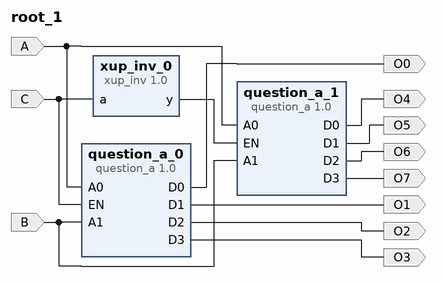
[diagram p0: block diagram of the top level]
# Vivado block design root_1, xc7a35tcpg236-1, Vivado 2023.1
create_bd_design root_1

create_bd_port -dir I A
create_bd_port -dir I B
create_bd_port -dir I C
create_bd_port -dir O O0
create_bd_port -dir O O1
create_bd_port -dir O O2
create_bd_port -dir O O3
create_bd_port -dir O O4
create_bd_port -dir O O5
create_bd_port -dir O O6
create_bd_port -dir O O7

create_bd_cell -type ip -vlnv xilinx.com:user:question_a:1.0 question_a_0
create_bd_cell -type ip -vlnv xilinx.com:user:question_a:1.0 question_a_1
create_bd_cell -type ip -vlnv xilinx.com:XUP:xup_inv:1.0 xup_inv_0

# ---- connections ----

connect_bd_net [get_bd_ports A] [get_bd_pins question_a_0/A0] [get_bd_pins question_a_1/A0]
connect_bd_net [get_bd_ports B] [get_bd_pins question_a_0/A1] [get_bd_pins question_a_1/A1]
connect_bd_net [get_bd_ports C] [get_bd_pins xup_inv_0/a] [get_bd_pins question_a_0/EN]
connect_bd_net [get_bd_pins question_a_0/D0] [get_bd_ports O0]
connect_bd_net [get_bd_pins question_a_0/D1] [get_bd_ports O1]
connect_bd_net [get_bd_pins question_a_0/D2] [get_bd_ports O2]
connect_bd_net [get_bd_pins question_a_0/D3] [get_bd_ports O3]
connect_bd_net [get_bd_pins question_a_1/D0] [get_bd_ports O4]
connect_bd_net [get_bd_pins question_a_1/D1] [get_bd_ports O5]
connect_bd_net [get_bd_pins question_a_1/D2] [get_bd_ports O6]
connect_bd_net [get_bd_pins question_a_1/D3] [get_bd_ports O7]
connect_bd_net [get_bd_pins xup_inv_0/y] [get_bd_pins question_a_1/EN]

validate_bd_design
save_bd_design
